# Altium project Okablowanie1egz1.PrjPcb
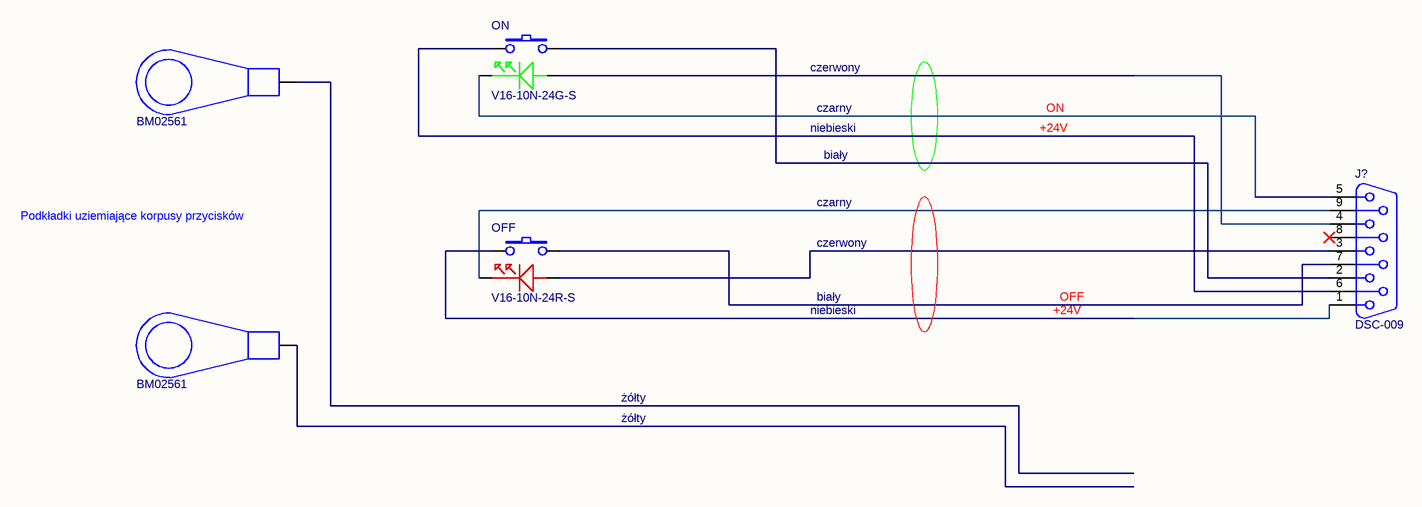
[diagram p0: Okablowanie1_main.SchDoc]
NazwaProjektu: Włącznik 230VAC na przekaźnikach - okablowanie pudełka
1 sheet, 5 parts. Net scope: global (net labels, ports and power ports of the same name join across sheets).

## Sheet Okablowanie1_main.SchDoc
size A4; LotOfPieces: 1

### Parts
Conn1  BM02561
Conn2  BM02561
J?  DSC-009
OFF  V16-10N-24R-S
ON  V16-10N-24G-S

### Nets
+24V: J?.1 J?.6 OFF.2 ON.2
OFF: J?.7 OFF.1
ON: J?.5 ON.CATH
NetJ?_2: J?.2 ON.1
NetJ?_3: J?.3 OFF.ANOD
NetJ?_4: J?.4 ON.ANOD
NetJ?_9: J?.9 OFF.CATH

Not connected (* = marked no-connect by the designer): Conn1 1(OCZKO); Conn2 1(OCZKO); J? 8*

### Notes on the sheet
- czerwony
- niebieski
- czarny
- Podkładki uziemiające korpusy przycisków
- biały
- żółty
- Wariant:
- Rev.
- /
- Projekt i wykonanie: (C) Miroslaw Lach MRQ, www.mlach.com
- git:
- Page:
- Plik:

### Library data of the parts
Conn1 Conn2 = Con276: PartIdx: Con276; Descript: Końcówka oczkowa; M16; 16mm2; zaciskanie; na przewód; cynowany; Identyfikator: 276; Value: BM02561; Reference5: BM02561; Supplier5: tme; Manufacturer5: BM Group; Price5: 4,7; Typ5: BM02561; DateOfPrice5: 2020-02-12
J? = CON305: Kod: CON305; ID: 305; Descript: D-Sub; PIN: 9; wtyk; męskie; na przewód; lutowanie; 5A; Reference5: bd; Value: DSC-009; Price5: 0,8; DateOfPrice5: 07-06-2020 19:25:18; Supplier5: bd; Manufacturer5: bd; Typ5: bd; Replacement: bd
OFF = Elm36: PartIdx: Elm36; Identyfikator: 36; Descript: Przełącznik: wandaloodporny; Poz: 2; SPST-NO; 2A/36VDC; IP65; Ø16mm; Value: V16-10N-24R-S; Supplier5: tme; Reference5: V16-10N-24R-S; Manufacturer5: ONPOW; Typ5: V16-10N-24R-S; Price5: 23; DateOfPrice5: 2020-02-12
ON = Elm21: PartIdx: Elm21; Identyfikator: 21; Descript: Przełącznik: wandaloodporny; Poz: 2; SPST-NO; 2A/36VDC; IP65; Ø16mm; Value: V16-10N-24G-S; Supplier5: tme; Reference5: V16-10N-24G-S; Manufacturer5: ONPOW; Typ5: V16-10N-24G-S; Price5: 24; DateOfPrice5: 2020-02-12